# Altium schematic sheet IFX9201.SchDoc
size A4
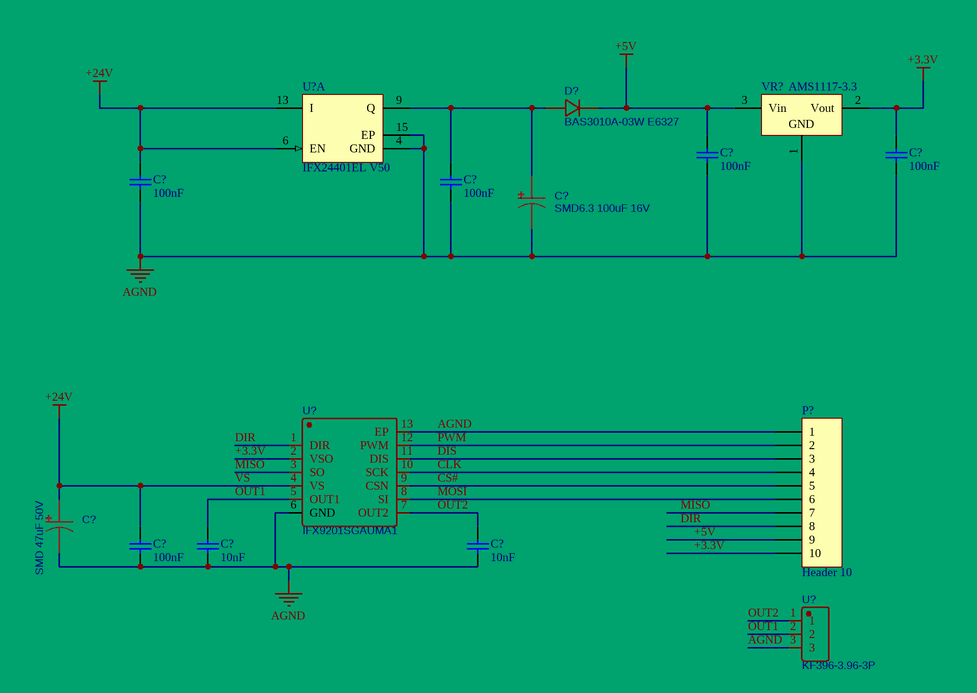
[diagram p0: IFX9201.SchDoc]

## Parts
(Parts that share a designator on the sheet are numbered #1, #2 ... from top to bottom, then left to right.)
C?#1  SMD6.3 100uF 16V  [CAP-SMD_BD6.3-L6.6-W6.6-FD]
C?#2  100nF  [0603_C]
C?#3  100nF  [0603_C]
C?#4  100nF  [0603_C]
C?#5  100nF  [0603_C]
C?#6  SMD 47uF 50V  [CAP-SMD_BD6.3-L6.6-W6.6-FD]
C?#7  100nF  [0603_C]
C?#8  10nF  [0603_C]
C?#9  10nF  [0603_C]
D?  BAS3010A-03W E6327  [SOD-323_L1.8-W1.3-LS2.5-RD]
P?  Header 10  [HDR1X10]
U?#1  IFX24401EL V50  [INF-PG-SSOP-14-1_N]  (part A of 2)
U?#2  IFX9201SGAUMA1  [SO-12_L6.4-W7.5-P1.00-LS10.3-BL-EP]
U?#3  KF396-3.96-3P  [CONN-TH_3P-P3.96_KF396-3.96-3P]
VR?  AMS1117-3.3  [SOT-223]

## Nets
+3.3V: C?#3.2 P?.10 U?#2.2(VSO) VR?.2(Vout)
+5V: C?#2.2 D?.1(C) P?.9 VR?.3(Vin)
AGND: C?#1.2 C?#2.1 C?#3.1 C?#4.1 C?#5.1 C?#6.2 C?#7.1 C?#8.1 C?#9.1 P?.1 U?#1.4(GND) U?#1.15(EP) U?#2.6(GND) U?#2.13(EP) U?#3.3 VR?.1(GND)
VS: C?#4.2 C?#6.1 C?#7.2 U?#1.6(EN) U?#1.13(I) U?#2.4(VS)  [also labelled +24V]
CLK: P?.4 U?#2.10(SCK)
CS#: P?.5 U?#2.9(CSN)
DIR: P?.8 U?#2.1(DIR)
DIS: P?.3 U?#2.11(DIS)
MISO: P?.7 U?#2.3(SO)
MOSI: P?.6 U?#2.8(SI)
OUT1: C?#8.2 U?#2.5(OUT1) U?#3.2
OUT2: C?#9.2 U?#2.7(OUT2) U?#3.1
PWM: P?.2 U?#2.12(PWM)
NetC?#1_1: C?#1.1 C?#5.2 D?.2(A) U?#1.9(Q)

## Library data of the parts
C?#1 = SMD6.3 100uF: UUD1C101MCL1GS; BOM_Manufacturer: Nichicon; BOM_Manufacturer Part: UUD1C101MCL1GS
C?#2-C?#5 C?#7 = 0603 2.7nF (272) 10% 50V: GCJ188R72A104KA01D; ComponentLink1Description: muRata; Package: 0603
C?#6 = SMD6.3 100uF: EEEFT1H470AP; BOM_Manufacturer: PANASONIC; BOM_Manufacturer Part: EEEFT1H470AP; Package: SMD,6.3x5.8mm
C?#8 C?#9 = 0603 2.7nF (272) 10% 50V: GCM188R72A103KA37D; ComponentLink1Description: muRata; Package: 0603
D? = BAS3010A-03W E6327: BOM_Manufacturer: Infineon Technologies; BOM_Manufacturer Part: BAS 3010A-03W E6327
P? = Header 10: Header, 10-Pin; LatestRevisionDate: 17-Jul-2002; LatestRevisionNote: Re-released for DXP Platform.; Publisher: Altium Limited
U?#1 = IFX24401EL V50: Low Dropout Voltage Regulator, 5.5 to 42 V Operating, 300 mA, -40 to 125 degC, PG-SSOP-14-1, Reel, Green; Manufacturer: Infineon; Accuracy: 2.0 %; Automotive Qualified: FALSE; Dropout Voltage: 250 mV; Green: TRUE; Max Number Reflow: 3; Max Peak Reflow Temp: 260 degC; Max. Output Current: 300 mA; Output Voltage: 5 V; Regulator Type: Linear->single output; Typical Quiescent Current: 20 uA; DatasheetVersion: Rev. 1.02; PackageVersion: Oct-08; PackageReference: PG-SSOP-14-1; PackageDescription: 14-Pin Plastic (Green) Shrink Small Outline Package, 4.9 x 3.9 mm Body, 0.65 mm Pitch; Supplier 1: Mouser; Supplier Part Number 1: 726-IFX24401ELV50; Supplier 2: Digi-Key; Supplier Part Number 2: IFX24401EL V50INTR-ND; Supplier 3: Digi-Key; Supplier Part Number 3: IFX24401EL V50INCT-ND; Supplier 4: Digi-Key; Supplier Part Number 4: IFX24401EL V50INDKR-ND; Halogen-free: TRUE; MSL: 3; Packing: Reel; Reset: FALSE; Status Output: FALSE; Mounting Technology: Surface Mount; PartNumber: IFX24401EL V50; ComponentLink1Description: Manufacturer URL; ComponentLink1URL: http://www.infineon.com/; ComponentLink2Description: Datasheet; ComponentLink2URL: http://www.infineon.com/dgdl/IFX24401_DS_102.pdf?folderId=db3a30431ff988150120802bce1d257a&fileId=db3a304320d39d590120f61fb4d269d5; ComponentLink3Description: Package Specification; ComponentLink3URL: http://www.infineon.com/dgdl/PG-SSOP-14-1%2C-2%2C-3-Package_Overview.pdf?folderId=db3a304319bc939a0119bdaa53bc000b&fileId=db3a30431cdffaa4011ce10d798a0009
U?#2 = IFX9201SGAUMA1: BOM_Manufacturer: Infineon; BOM_Manufacturer Part: IFX9201SGAUMA1
U?#3 = KF396-3.96-3P: BOM_Manufacturer: Cixi Kefa Elec; Contributor: LCSC; BOM_Supplier: LCSC; BOM_Supplier Part: C474895; BOM_Manufacturer Part: KF396-3.96-3P; spicePre: U; spiceSymbolName: KF396-3.96-3P
VR? = SOT-223 AMS1117-3.3: 低压差线性稳压(LDO); ComponentLink1Description: 供应商链接; ComponentLink1URL: http://www.szlcsc.com/product/details_6652.html; Package: SOT-223; Supplier: LC; SuppliersPartNumber: C6186